# EAGLE design Controller v2 (EAGLE 9.6.2)
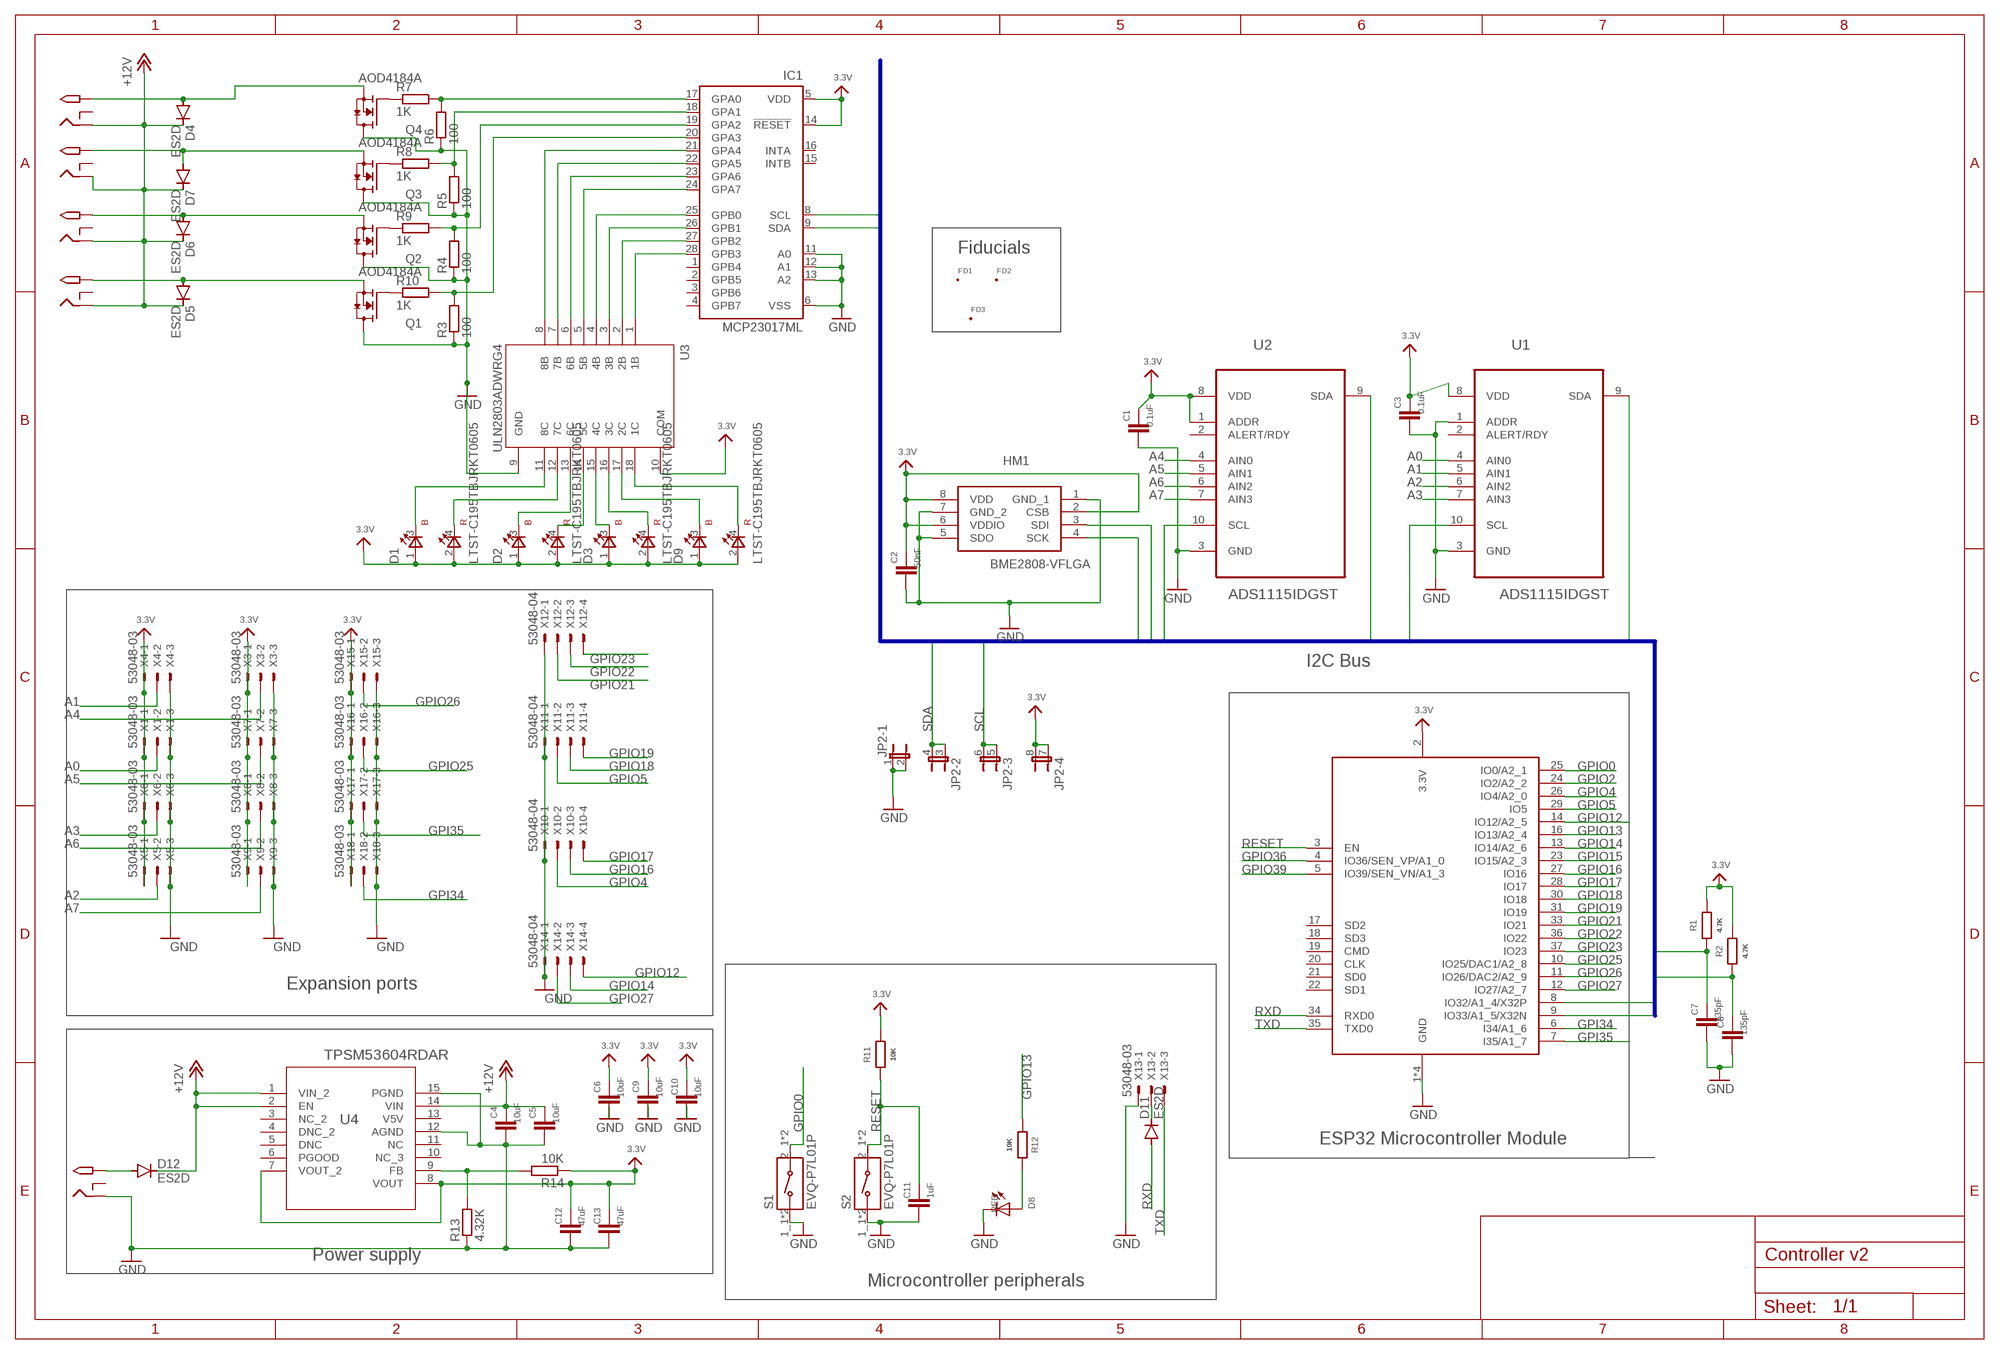
[diagram p0: schematic, sheet 1]

## Parts
12V_OUT_A  2.1MMJACKTHM  [PJ-102A]
12V_OUT_B  2.1MMJACKTHM  [PJ-102A]
12V_OUT_C  2.1MMJACKTHM  [PJ-102A]
12V_OUT_D  2.1MMJACKTHM  [PJ-102A]
C1  0.1uF  C-EUC0603  [C0603]
C2  50nF  C-EUC0603  [C0603]
C3  0.1uF  C-EUC0603  [C0603]
C4  10uF  C-EUC0805K  [C0805K]
C5  10uF  C-EUC0805K  [C0805K]
C6  10uF  C-EUC0805K  [C0805K]
C7  135pF  C-EUC0603  [C0603]
C8  135pF  C-EUC0603  [C0603]
C9  10uF  C-EUC0805K  [C0805K]
C10  10uF  C-EUC0805K  [C0805K]
C11  1uF  C-EUC0805K  [C0805K]
C12  47uF  C-EUC0805K  [C0805K]
C13  47uF  C-EUC0805K  [C0805K]
D1  LTST-C195TBJRKT0605  [LED_LTST-C195TBJRKT]
D2  LTST-C195TBJRKT0605  [LED_LTST-C195TBJRKT]
D3  LTST-C195TBJRKT0605  [LED_LTST-C195TBJRKT]
D4  ES2D  [SMB]
D5  ES2D  [SMB]
D6  ES2D  [SMB]
D7  ES2D  [SMB]
D8  RED  LEDCHIPLED_0805  [CHIPLED_0805]
D9  LTST-C195TBJRKT0605  [LED_LTST-C195TBJRKT]
D11  ES2D  [SMB]
D12  ES2D  [SMB]
FD1  FID_20MIL  [FID_020]
FD2  FID_20MIL  [FID_020]
FD3  FID_20MIL  [FID_020]
HM1  BME2808-VFLGA  [BME280]
IC1  MCP23017ML  [QFN28-ML_6X6MM]
JP2  3.3V  JP4QE  [JP4Q]
PWRIN  2.1MMJACKTHM  [PJ-102A]
Q1  AOD4184A  [D-PAK_TO252AA]
Q2  AOD4184A  [D-PAK_TO252AA]
Q3  AOD4184A  [D-PAK_TO252AA]
Q4  AOD4184A  [D-PAK_TO252AA]
R1  4.7K  R-EU_R0805  [R0805]
R2  4.7K  R-EU_R0805  [R0805]
R3  100  R-EU_R0402  [R0402]
R4  100  R-EU_R0402  [R0402]
R5  100  R-EU_R0402  [R0402]
R6  100  R-EU_R0402  [R0402]
R7  1K  R-EU_R0402  [R0402]
R8  1K  R-EU_R0402  [R0402]
R9  1K  R-EU_R0402  [R0402]
R10  1K  R-EU_R0402  [R0402]
R11  10K  R-EU_R0603  [R0603]
R12  10K  R-EU_R0805  [R0805]
R13  4.32K  R-EU_R0402  [R0402]
R14  10K  R-EU_R0402  [R0402]
S1  EVQ-P7L01P  [SW_EVQ-P7L01P]
S2  EVQ-P7L01P  [SW_EVQ-P7L01P]
U1  ADS1115IDGST  [SOP50P490X110-10N]
U2  ADS1115IDGST  [SOP50P490X110-10N]
U3  ULN2803ADWRG4  [SOIC127P1030X265-18N]
U4  TPSM53604RDAR  [B3QFN14_RDA_TEX]
X1  53048-03  [53048-03]
X2  ESP32_WROOM32  [WROOM32]
X3  53048-03  [53048-03]
X4  53048-03  [53048-03]
X5  53048-03  [53048-03]
X6  53048-03  [53048-03]
X7  53048-03  [53048-03]
X8  53048-03  [53048-03]
X9  53048-03  [53048-03]
X10  53048-04  [53048-04]
X11  53048-04  [53048-04]
X12  53048-04  [53048-04]
X13  53048-03  [53048-03]
X14  53048-04  [53048-04]
X15  53048-03  [53048-03]
X16  53048-03  [53048-03]
X17  53048-03  [53048-03]
X18  53048-03  [53048-03]

## Nets
3.3V: C1.1 C2.1 C3.1 C6.1 C9.1 C10.1 C12.1 C13.1 D1.1(A1) D1.2(A2) D2.1(A1) D2.2(A2) D3.1(A1) D3.2(A2) D9.1(A1) D9.2(A2) HM1.2(CSB) HM1.6(VDDIO) HM1.8(VDD) IC1.5(VDD) IC1.14(!RESET) JP2.7 JP2.8 R1.2 R2.2 R11.2 R14.1 U1.8(VDD) U2.1(ADDR) U2.8(VDD) U3.10(COM) U4.7(VOUT_2) U4.8(VOUT) X1.1 X2.2(3.3V) X3.1 X4.1 X5.1 X6.1 X7.1 X8.1 X9.1 X15.1 X16.1 X17.1 X18.1
+12V: 12V_OUT_A.RING 12V_OUT_B.RING 12V_OUT_C.RING 12V_OUT_D.RING C4.1 C5.1 D4.C D5.C D6.C D7.C D12.C U4.1(VIN_2) U4.2(EN) U4.14(VIN)
A0: U1.4(AIN0) X1.2
A1: U1.5(AIN1) X4.2
A2: U1.6(AIN2) X5.2
A3: U1.7(AIN3) X6.2
A4: U2.4(AIN0) X3.2
A5: U2.5(AIN1) X7.2
A6: U2.6(AIN2) X8.2
A7: U2.7(AIN3) X9.2
GND: C1.2 C2.2 C3.2 C4.2 C5.2 C6.2 C7.2 C8.2 C9.2 C10.2 C11.2 C12.2 C13.2 D8.C HM1.1(GND_1) HM1.5(SDO) HM1.7(GND_2) IC1.6(VSS) IC1.11(A0) IC1.12(A1) IC1.13(A2) JP2.1 JP2.2 PWRIN.RING Q1.4(D) Q2.4(D) Q3.4(D) Q4.4(D) R3.1 R4.1 R5.1 R6.1 R13.1 S1.1_1 S1.1_2 S2.1_1 S2.1_2 U1.1(ADDR) U1.3(GND) U2.3(GND) U3.9(GND) U4.12(AGND) U4.15(PGND) X1.3 X2.1(GND) X2.15(GND) X2.38(GND) X2.P$1(GND) X3.3 X4.3 X5.3 X6.3 X7.3 X8.3 X9.3 X10.1 X11.1 X12.1 X13.1 X14.1 X15.3 X16.3 X17.3 X18.3
GPI34: X2.6(I34/A1_6) X18.2
GPI35: X2.7(I35/A1_7) X17.2
GPIO0: S1.2_1 S1.2_2 X2.25(IO0/A2_1)
GPIO2: X2.24(IO2/A2_2)
GPIO4: X2.26(IO4/A2_0) X10.2
GPIO5: X2.29(IO5) X11.2
GPIO12: X2.14(IO12/A2_5) X14.4
GPIO13: R12.1 X2.16(IO13/A2_4)
GPIO14: X2.13(IO14/A2_6) X14.3
GPIO15: X2.23(IO15/A2_3)
GPIO16: X2.27(IO16) X10.3
GPIO17: X2.28(IO17) X10.4
GPIO18: X2.30(IO18) X11.3
GPIO19: X2.31(IO19) X11.4
GPIO21: X2.33(IO21) X12.2
GPIO22: X2.36(IO22) X12.3
GPIO23: X2.37(IO23) X12.4
GPIO25: X2.10(IO25/DAC1/A2_8) X16.2
GPIO26: X2.11(IO26/DAC2/A2_9) X15.2
GPIO27: X2.12(IO27/A2_7) X14.2
GPIO36: X2.4(IO36/SEN_VP/A1_0)
GPIO39: X2.5(IO39/SEN_VN/A1_3)
N$1: IC1.17(GPA0) R6.2 R7.2
N$2: IC1.18(GPA1) R5.2 R8.2
N$3: IC1.20(GPA3) R3.2 R10.2
N$4: IC1.19(GPA2) R4.2 R9.2
N$5: Q1.1(G) R10.1
N$6: D12.A PWRIN.TIP
N$7: Q2.1(G) R9.1
N$8: IC1.21(GPA4) U3.8(8B)
N$9: Q3.1(G) R8.1
N$10: Q4.1(G) R7.1
N$11: D11.C X13.2
N$12: IC1.22(GPA5) U3.7(7B)
N$13: IC1.23(GPA6) U3.6(6B)
N$14: IC1.24(GPA7) U3.5(5B)
N$15: D8.A R12.2
N$16: IC1.25(GPB0) U3.4(4B)
N$17: IC1.26(GPB1) U3.3(3B)
N$18: IC1.27(GPB2) U3.2(2B)
N$19: IC1.28(GPB3) U3.1(1B)
N$20: D1.3(K1) U3.11(8C)
N$21: D1.4(K2) U3.12(7C)
N$22: D2.3(K1) U3.13(6C)
N$23: D2.4(K2) U3.14(5C)
N$24: D3.3(K1) U3.15(4C)
N$25: D3.4(K2) U3.16(3C)
N$26: D9.3(K1) U3.17(2C)
N$27: D9.4(K2) U3.18(1C)
N$29: R13.2 R14.2 U4.9(FB)
RESET: C11.1 R11.1 S2.2_1 S2.2_2 X2.3(EN)
RXD: D11.A X2.34(RXD0)
SCL: C7.1 HM1.4(SCK) IC1.8(SCL) JP2.5 JP2.6 R1.1 U1.10(SCL) U2.10(SCL) X2.9(IO33/A1_5/X32N)
SDA: C8.1 HM1.3(SDI) IC1.9(SDA) JP2.3 JP2.4 R2.1 U1.9(SDA) U2.9(SDA) X2.8(IO32/A1_4/X32P)
TXD: X2.35(TXD0) X13.3
V_COL1: 12V_OUT_A.TIP D4.A Q4.3(S)
V_COL2: 12V_OUT_B.TIP D7.A Q3.3(S)
V_COL3: 12V_OUT_C.TIP D6.A Q2.3(S)
V_COL4: 12V_OUT_D.TIP D5.A Q1.3(S)
Unconnected: 12V_OUT_A.RING_SW 12V_OUT_B.RING_SW 12V_OUT_C.RING_SW 12V_OUT_D.RING_SW IC1.1(GPB4) IC1.2(GPB5) IC1.3(GPB6) IC1.4(GPB7) IC1.15(INTB) IC1.16(INTA) PWRIN.RING_SW U1.2(ALERT/RDY) U2.2(ALERT/RDY) U4.3(NC_2) U4.4(DNC_2) U4.5(DNC) U4.6(PGOOD) U4.10(NC_3) U4.11(NC) U4.13(V5V) X2.17(SD2) X2.18(SD3) X2.19(CMD) X2.20(CLK) X2.21(SD0) X2.22(SD1)

## Buses
I2C:SCL,SDA

## Notes on the sheet
- Fiducials
- I2C Bus
- Expansion ports
- ESP32 Microcontroller Module
- Power supply
- Microcontroller peripherals

## Library data of the parts
12V_OUT_A 12V_OUT_B 12V_OUT_C 12V_OUT_D PWRIN = adafruit:2.1MMJACK: 2.1mm x 5.5mm THM DC jack with internal switch. Digikey part #PJ-102A, 4UCON part #05537 2.1mm x 5.5mm SMT DC jack with internal switch. Digikey part #PJ-002A-SMT, 4UCON part #03267 By microbuilder.eu & adafruit.com; DATASHEET: https://www.cuidevices.com/product/resource/pj-102a.pdf; DESCRIPTION: CONN PWR JACK 2X5.5MM SOLDER; MF: CUI Devices; MPN: PJ-102A; TYPE: PTH
C1-C13 = rcl:C-EU: CAPACITOR, European symbol; SPICEPREFIX: C
D1-D3 D9 = LTST-C195TBJRKT:LTST-C195TBJRKT: Blue/Red 1.6 x 1.5 x 0.55 mm 130° Clear 45 mcd 3.3/2 V LED SMT; DATASHEET: http://optoelectronics.liteon.com/upload/download/DS22-2001-079/LTST-C195TBJRKT%20.pdf; DESCRIPTION: Blue, Red 470nm Blue, 631nm Red LED Indication - Discrete 3.3V Blue, 2V Red 0605 _1613 Metric_; DIGI-KEY_PART_NUMBER: 160-2020-1-ND; DIGI-KEY_PURCHASE_URL: https://www.digikey.com/product-detail/en/lite-on-inc/LTST-C195TBJRKT/160-2020-1-ND/3711399?utm_source=snapeda&utm_medium=aggregator&utm_campaign=symbol; MF: Lite-On Inc.; MPN: LTST-C195TBJRKT; PACKAGE: 0605 Lite-On; TYPE: SMD
D4-D7 D11 D12 = diode:ES2D: DIODE super fast rectifier, 2 A; DATASHEET: https://www.onsemi.com/pub/Collateral/ES2D-D.pdf; DESCRIPTION: DIODE GEN PURP 200V 2A DO214AA; DIGI-KEY-PART-NUMBER: ES2DFSCT-ND; MF: ON Semiconductor; MPN: ES2D; PACKAGE: DO-214AA, SMB; TYPE: SMD
D8 = adafruit:LED: LED OSRAM: - CHIPLED LG R971, LG N971, LY N971, LG Q971, LY Q971, LO R971, LY R971 LH N974, LH R974 LS Q976, LO Q976, LY Q976 LO Q996 - Hyper CHIPLED LW Q18S LB Q993, LB Q99A, LB R99A - SideLED LS A670, LO A670, LY A670, LG A670, LP A670 LB A673, LV A673, LT A673, LW A673 LH A674 LY A675 LS A676, LA A676, LO A676, LY A676, LW A676 LS A679, LY A679, LG A679 - Hyper Micro SIDELED® LS Y876, LA Y876, LO Y876, LY Y876 LT Y87S - SmartLED LW L88C, LW L88S LB L89C, LB L89S, LG L890 LS L89K, LO L89K, LY L89K LS L896, LA L896, LO L896, LY L896 - TOPLED LS T670, LO T670, LY T670, LG T670, LP T670 LSG T670, LSP T670, LSY T670, LOP T670, LYG T670 LG T671, LOG T671, LSG T671 LB T673, LV T673, LT T673, LW T673 LH T674 LS T676, LA T676, LO T676, LY T676, LB T676, LH T676, LSB T676, LW T676 LB T67C, LV T67C, LT T67C, LS T67K, LO T67K, LY T67K, LW E67C LS E67B, LA E67B, LO E67B, LY E67B, LB E67C, LV E67C, LT E67C LW T67C LS T679, LY T679, LG T679 LS T770, LO T770, LY T770, LG T770, LP T770 LB T773, LV T773, LT T773, LW T773 LH T774 LS E675, LA E675, LY E675, LS T675 LS T776, LA T776, LO T776, LY T776, LB T776 LHGB T686 LT T68C, LB T68C - Hyper Mini TOPLED® LB M676 - Mini TOPLED Santana® LG M470 LS M47K, LO M47K, LY M47K Source: http://www.osram.convergy.de/
FD1-FD3 = Fiducial:FID: Fiducial marks. Top and Bottom copper with stop mask
HM1 = SamacSys_Parts:BME280: Board Mount Humidity Sensors Source: Datasheet <https://componentsearchengine.com/Datasheets/1/BME280.pdf>; DATASHEET: https://ae-bst.resource.bosch.com/media/_tech/media/datasheets/BST-BME280-DS002.pdf; DESCRIPTION: Board Mount Humidity Sensors; MF: Bosch Sensortec; MPN: BME280; PACKAGE: 8-VFLGA; TYPE: SMD
IC1 = microchip:MCP23017: http://ww1.microchip.com/downloads/en/DeviceDoc/21952a.pdf Source: http://ww1.microchip.com/downloads/en/DeviceDoc/21952a.pdf; DATASHEET: http://ww1.microchip.com/downloads/en/DeviceDoc/20001952C.pdf; MF: MICROCHIP; MPN: MCP23017-E/ML; OC_FARNELL: unknown; OC_NEWARK: 31K2957; PACKAGE: 28-VQFN Exposed Pad; TYPE: SMD
JP2 = jumper:JP4QE: JUMPER
Q1-Q4 = AOD4184A:AOD4184A: Trans MOSFET N-CH 40V 50A 3-Pin(2+Tab) DPAK; DESCRIPTION: N-Channel 40V 13A _Ta_, 50A _Tc_ 2.3W _Ta_, 50W _Tc_ Surface Mount TO-252, _D-Pak_; DIGI-KEY_PART_NUMBER: 785-1221-1-ND; DIGI-KEY_PURCHASE_URL: https://www.digikey.com/product-detail/en/alpha-omega-semiconductor-inc/AOD4184A/785-1221-1-ND/2353939?utm_source=snapeda&utm_medium=aggregator&utm_campaign=symbol; MF: Alpha &; MPN: AOD4184A; PACKAGE: Surface Mount TO-252 (D-Pak); TYPE: SMD
R1 R2 = rcl:R-EU_: RESISTOR, European symbol; PACKAGE: R0603; SPICEPREFIX: R
R3-R10 R13 R14 = rcl:R-EU_: RESISTOR, European symbol; PACKAGE: R0402; SPICEPREFIX: R
R11 R12 = rcl:R-EU_: RESISTOR, European symbol; PACKAGE: 0603; SPICEPREFIX: R
S1 S2 = EVQ-P7L01P:EVQ-P7L01P: Switch Tactile N.O. SPST Rectangular Button Gull Wing 0.05A 12VDC 100000Cycle 1.6N SMD Embossed T/R; DESCRIPTION: SWITCH TACTILE SPST-NO 0.05A 12V; DIGI-KEY_PART_NUMBER: P16769CT-ND; DIGI-KEY_PURCHASE_URL: https://www.digikey.com/product-detail/en/panasonic-electronic-components/EVQ-P7L01P/P16769CT-ND/4429462?utm_source=snapeda&utm_medium=aggregator&utm_campaign=symbol; MF: Panasonic Electronic Components; MPN: EVQ-P7L01P; PACKAGE: SPST; TYPE: SMD
U1 U2 = Texas Instruments_By_element14_Batch_1:ADS1115IDGST: Analog-to-Digital Converter with Internal Reference; DATASHEET: http://www.ti.com/general/docs/suppproductinfo.tsp?distId=10&gotoUrl=http%3A%2F%2Fwww.ti.com%2Flit%2Fgpn%2Fads1113; MF: Texas Instruments; MPN: ADS1115IDGST; OC_FARNELL: 1762981; OC_NEWARK: 25R1241; PACKAGE: MSOP-10; TYPE: SMD
U3 = ULN2803ADWRG4:ULN2803ADWRG4: Trans Darlington NPN 50V 0.5A 18-Pin SOIC T/R; DATASHEET: http://www.ti.com/general/docs/suppproductinfo.tsp?distId=10&gotoUrl=http%3A%2F%2Fwww.ti.com%2Flit%2Fgpn%2Fuln2803a; DESCRIPTION: Bipolar _BJT_ Transistor Array 8 NPN Darlington 50V 500mA Surface Mount 18-SOIC; DIGI-KEY_PART_NUMBER: 296-35964-1-ND; DIGI-KEY_PURCHASE_URL: https://www.digikey.com/product-detail/en/texas-instruments/ULN2803ADWRG4/296-35964-1-ND/4134939?utm_source=snapeda&utm_medium=aggregator&utm_campaign=symbol; MF: Texas Instruments; MPN: ULN2803ADWRG4; PACKAGE: SOIC-18 Texas Instruments; TYPE: SMD
U4 = TPSM53604:TPSM53604RDAR; BUILT_BY: EMA_Cory; COPYRIGHT: Copyright (C) 2018 Accelerated Designs. All rights reserved; DATASHEET: https://www.ti.com/lit/ds/symlink/tpsm53604.pdf; MANUFACTURER_PART_NUMBER: TPSM53604RDAR; SOURCELIBRARY: TI_2020-03-16; VENDOR: Texas Instruments
X1 X3-X9 X13 X15-X18 = con-molex:53?-03: CONNECTOR wire to board 1.25 mm (.049 inch) pitch header; DATASHEET: https://www.molex.com/webdocs/datasheets/pdf/en-us/0530480310_PCB_HEADERS.pdf; MF: WALDOM/MOLEX; MPN: 53048-0310; OC_FARNELL: 9732918; OC_NEWARK: 38C9908; TYPE: PTH
X2 = microbuilder:ESP32_WROOM32; DESCRIPTION: ESP32 Module - DO NOT ASSEMBLE; MF: N/A; MPN: N/A; PACKAGE: IGNORE - DO NOT ASSEMBLE; TYPE: IGNORE - DO NOT ASSEMBLE
X10-X12 X14 = con-molex:53?-04: CONNECTOR wire to board 1.25 mm (.049 inch) pitch header; DATASHEET: https://www.molex.com/webdocs/datasheets/pdf/en-us/0530480410_PCB_HEADERS.pdf; MF: MOLEX; MPN: 53048-0410; OC_FARNELL: 1462887; OC_NEWARK: 57H4721; TYPE: PTH

## Board
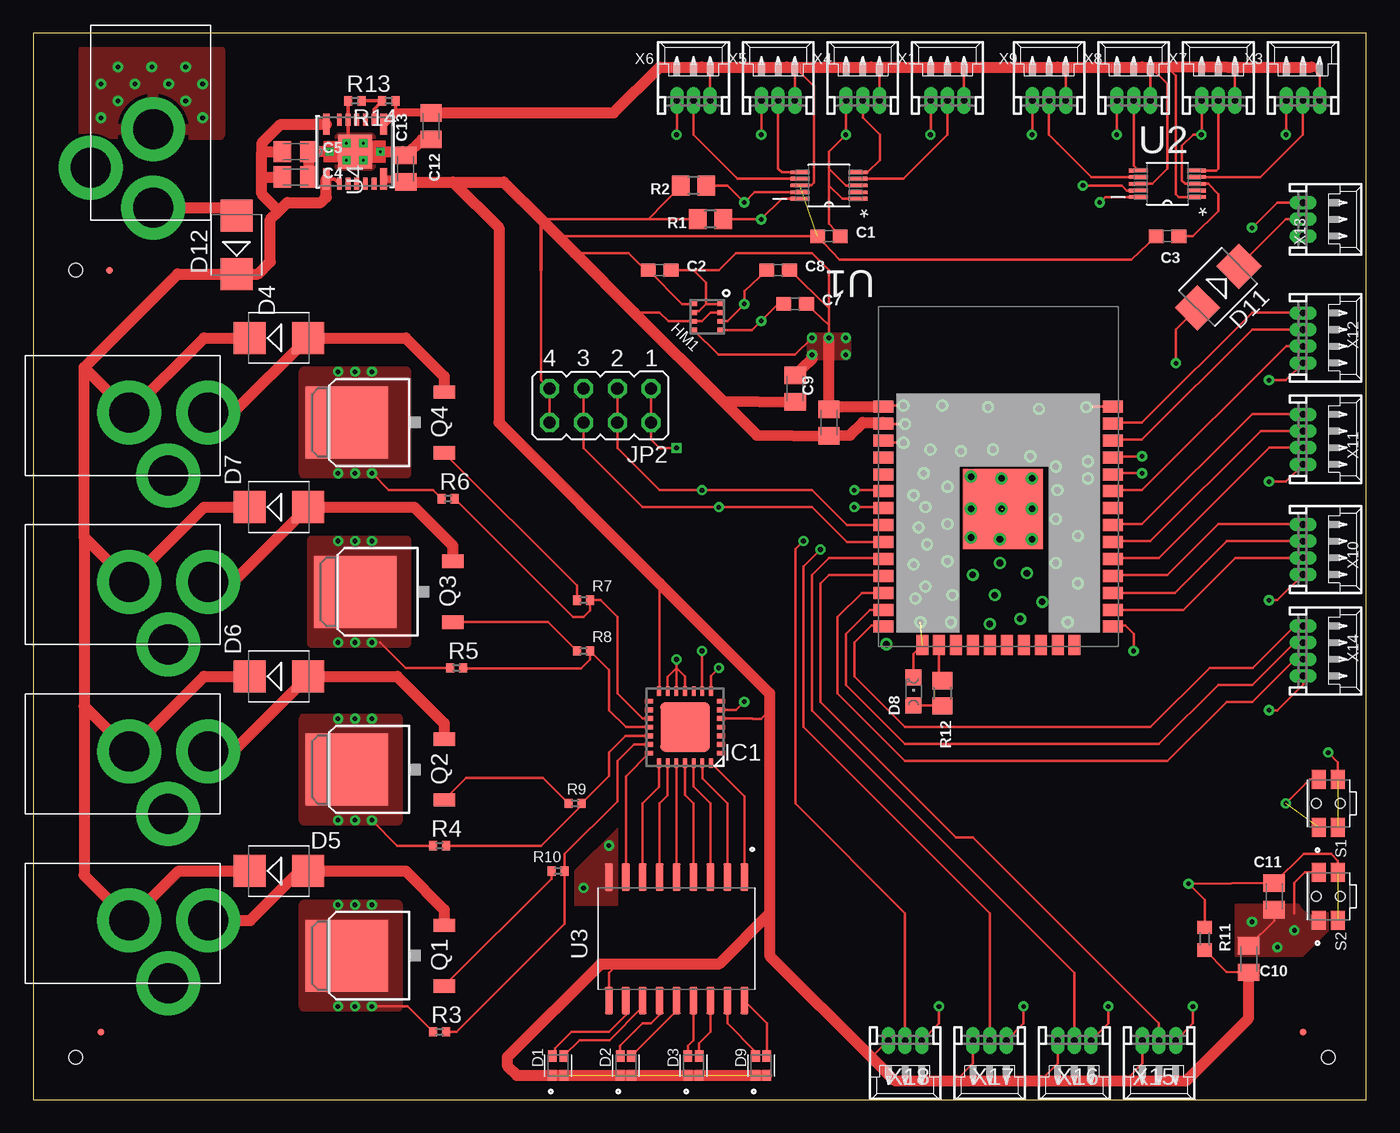
[diagram p1: board, top side]
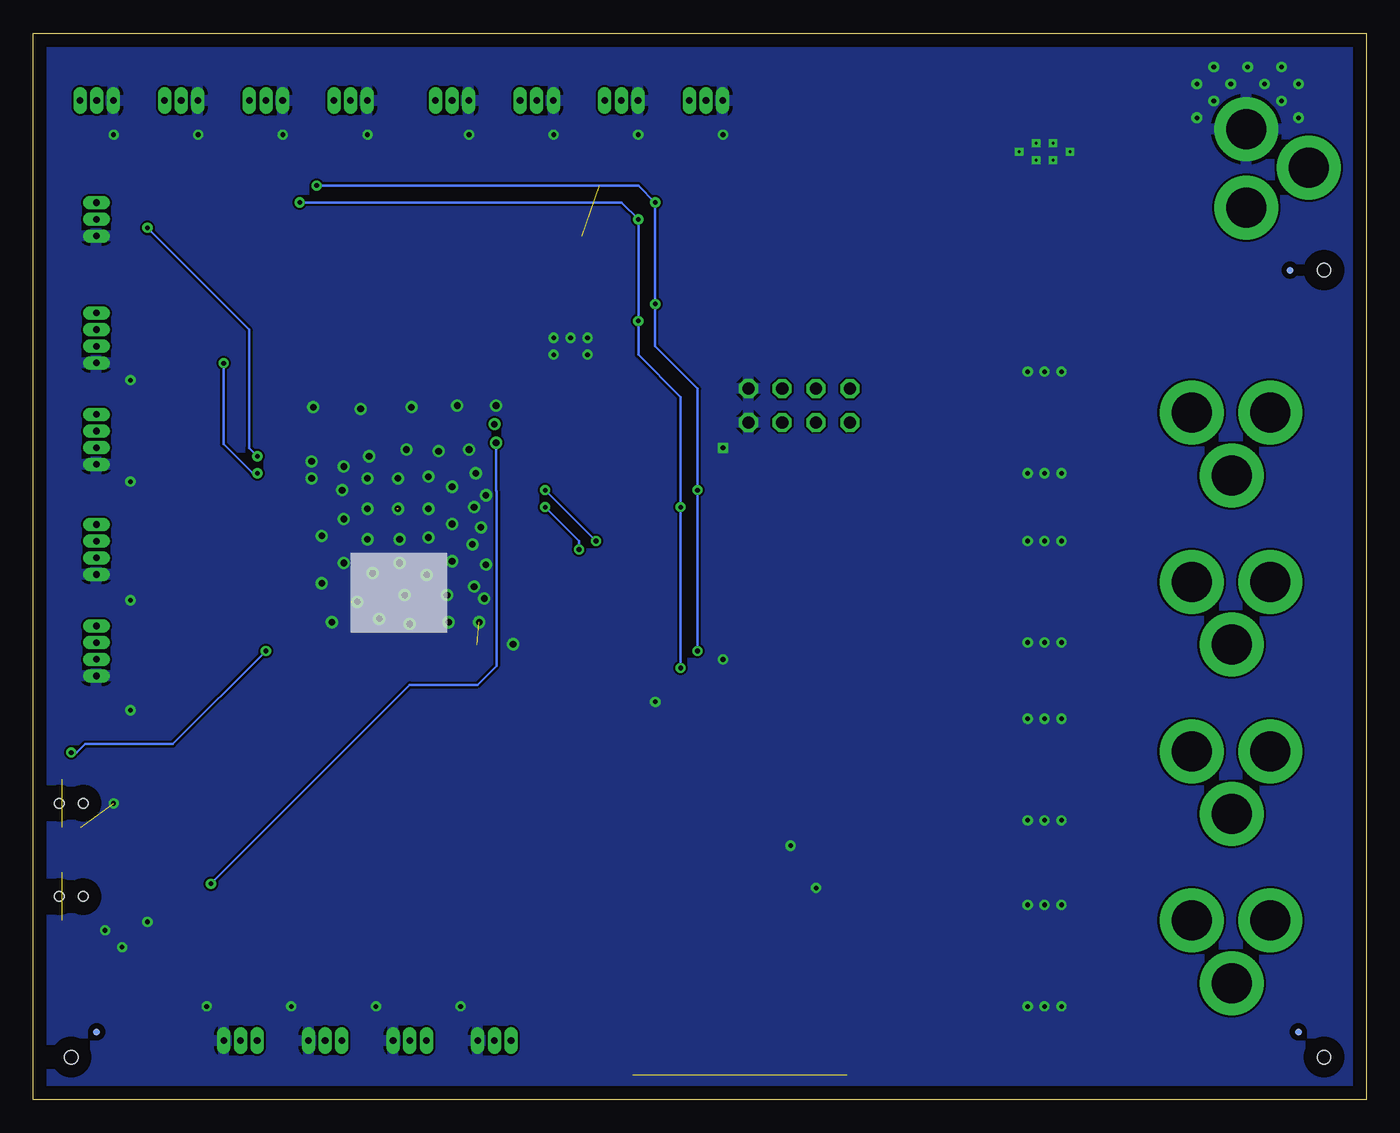
[diagram p2: board, bottom side, seen from below]

Size 100 x 80 mm. Coordinates in mm from the lower left corner, seen from the top.
Outline: 0,0 100,0 100,80 0,80 0,0
Copper layers (1*16): Top 0.035mm / dielectric 1.5mm / Bottom 0.035mm
Design rules "default *": minimum track width 6mil, minimum drill 0.35mm, track to track 6mil, track to pad 6mil, pad to pad 6mil, via to via 6mil, smd to smd 6mil, copper to edge 40mil, drill to drill 6mil, minimum pad ring 10mil, minimum via ring 8mil, stop-mask expansion 4mil, vias tented up to drill 0mil, thermal gap 10mil
Holes 1 mm at 3.17,3.17 97.16,3.17 3.17,62.23

### Footprints (pad centres in the part's own frame; a part is rotated, then mirrored left to right if it is on the bottom)
PJ-102A = drill 3 pad 4.8: RING 0.1,-3.39; RING_SW -4.6,-6.29; TIP 0.1,-9.29
C0603 = smd 1.1 x 1: 1 -0.85,0; 2 0.85,0
C0805K = smd 1.3 x 1.6: 1 -1,0; 2 1,0
LED_LTST-C195TBJRKT = smd 0.85 x 0.65: 1 -0.725,0.425; 2 -0.725,-0.425; 3 0.725,0.425; 4 0.725,-0.425
SMB = smd 2.4 x 2.4: A 2.2,0; C -2.2,0
CHIPLED_0805 = smd 1.2 x 1.2: A 0,-1.05; C 0,1.05
FID_020 = smd 0.508 x 0.508 bottom: FIDB 0,0 | smd 0.508 x 0.508: FIDT 0,0
BME280 = smd 0.5 x 0.35: 1 2.05,0; 2 2.05,-0.65; 3 2.05,-1.3; 4 2.05,-1.95; 5 0,-1.95; 6 0,-1.3; 7 0,-0.65; 8 0,0
QFN28-ML_6X6MM = smd 0.7 x 0.35: 1 -2.7,1.95; 2 -2.7,1.3; 3 -2.7,0.65; 4 -2.7,0; 5 -2.7,-0.65; 6 -2.7,-1.3; 7 -2.7,-1.95; 15 2.7,-1.95; 16 2.7,-1.3; 17 2.7,-0.65; 18 2.7,0; 19 2.7,0.65; 20 2.7,1.3; 21 2.7,1.95 | smd 0.35 x 0.7: 8 -1.95,-2.7; 9 -1.3,-2.7; 10 -0.65,-2.7; 11 0,-2.7; 12 0.65,-2.7; 13 1.3,-2.7; 14 1.95,-2.7; 22 1.95,2.7; 23 1.3,2.7; 24 0.65,2.7; 25 0,2.7; 26 -0.65,2.7; 27 -1.3,2.7; 28 -1.95,2.7 | smd 3.7 x 3.7: EXP 0,0
JP4Q = drill 0.914 octagon: 1 -3.81,-1.27; 2 -3.81,1.27; 3 -1.27,-1.27; 4 -1.27,1.27; 5 1.27,-1.27; 6 1.27,1.27; 7 3.81,-1.27; 8 3.81,1.27
D-PAK_TO252AA = smd 1 x 1.6: 1 -2.28,-4.8; 3 2.28,-4.8 | smd 5.4 x 6.2: 4 0,2.5
R0805 = smd 1.3 x 1.5: 1 -0.95,0; 2 0.95,0
R0402 = smd 0.6 x 0.7: 1 -0.5,0; 2 0.5,0
R0603 = smd 1 x 1.1: 1 -0.85,0; 2 0.85,0
SW_EVQ-P7L01P = smd 1.4 x 1.05: 1_1 -1.8,0.725; 1_2 1.8,0.725; 2_1 -1.8,-0.725; 2_2 1.8,-0.725 | hole 0.7: 0,0.9; 0,-0.9
SOP50P490X110-10N = smd 1.422 x 0.279: 1 -2.184,0.991; 2 -2.184,0.508; 3 -2.184,0; 4 -2.184,-0.508; 5 -2.184,-0.991; 6 2.184,-0.991; 7 2.184,-0.508; 8 2.184,0; 9 2.184,0.508; 10 2.184,0.991
SOIC127P1030X265-18N = smd 2.06 x 0.6: 1 -4.64,5.08; 2 -4.64,3.81; 3 -4.64,2.54; 4 -4.64,1.27; 5 -4.64,0; 6 -4.64,-1.27; 7 -4.64,-2.54; 8 -4.64,-3.81; 9 -4.64,-5.08; 10 4.64,-5.08; 11 4.64,-3.81; 12 4.64,-2.54; 13 4.64,-1.27; 14 4.64,0; 15 4.64,1.27; 16 4.64,2.54; 17 4.64,3.81; 18 4.64,5.08
B3QFN14_RDA_TEX = smd 1.6 x 0.508: 1 -2.057,2.145; 7 -2.057,-2.155; 8 2.057,-2.155; 14 2.057,2.145 | smd 0.914 x 0.356: 2 -2.4,1.17; 3 -2.4,0.52; 4 -2.4,-0.13; 5 -2.4,-0.78; 6 -2.4,-1.43; 9 2.4,-1.43; 10 2.4,-0.78; 11 2.4,-0.13; 12 2.4,0.52; 13 2.4,1.17 | smd 2.54 x 2.54: 15 0,0
53048-03 = drill 0.5 pad 0.698 long: 1 1.25,-1.25; 2 0,-1.25; 3 -1.25,-1.25
WROOM32 = smd 1.5 x 0.9: 1 -8.6,5; 2 -8.6,3.73; 3 -8.6,2.46; 4 -8.6,1.19; 5 -8.6,-0.08; 6 -8.6,-1.35; 7 -8.6,-2.62; 8 -8.6,-3.89; 9 -8.6,-5.16; 10 -8.6,-6.43; 11 -8.6,-7.7; 12 -8.6,-8.97; 13 -8.6,-10.24; 14 -8.6,-11.51; 25 8.6,-11.51; 26 8.6,-10.24; 27 8.6,-8.97; 28 8.6,-7.7; 29 8.6,-6.43; 30 8.6,-5.16; 31 8.6,-3.89; 32 8.6,-2.62; 33 8.6,-1.35; 34 8.6,-0.08; 35 8.6,1.19; 36 8.6,2.46; 37 8.6,3.73; 38 8.6,5 | smd 0.9 x 1.5: 15 -5.7,-12.9; 16 -4.43,-12.9; 17 -3.16,-12.9; 18 -1.89,-12.9; 19 -0.62,-12.9; 20 0.65,-12.9; 21 1.92,-12.9; 22 3.19,-12.9; 23 4.46,-12.9; 24 5.73,-12.9 | smd 6 x 6: P$1 0.34,-2.7
53048-04 = drill 0.5 pad 0.698 long: 1 1.875,-1.25; 2 0.625,-1.25; 3 -0.625,-1.25; 4 -1.875,-1.25

### Placement (x,y rotation side)
12V_OUT_A  3.81,51.44 90 top
12V_OUT_B  3.81,38.73 90 top
12V_OUT_C  3.81,26.04 90 top
12V_OUT_D  3.81,13.34 90 top
C1  59.69,64.77 0 top
C2  46.99,62.23 0 top
C3  85.09,64.77 0 top
C4  19.68,69.22 0 top
C5  19.68,71.12 0 top
C6  57.15,53.34 90 top
C7  57.15,59.69 0 top
C8  55.88,62.23 0 top
C9  59.69,50.8 90 top
C10  91.19,10.54 90 top
C11  93.09,15.24 270 top
C12  29.84,73.03 270 top
C13  27.94,69.85 90 top
D1  39.37,2.54 90 top
D2  44.45,2.54 90 top
D3  49.53,2.54 90 top
D4  18.41,57.15 0 top
D5  18.41,17.14 0 top
D6  18.41,31.75 0 top
D7  18.41,44.45 0 top
D8  66.04,30.61 0 top
D9  54.61,2.54 90 top
D11  88.9,60.96 225 top
D12  15.24,64.14 90 top
FD1  5.08,5.08 0 top
FD2  5.71,62.23 0 top
FD3  95.25,5.08 0 top
HM1  49.53,59.69 0 top
IC1  48.9,27.94 180 top
JP2  42.55,52.07 180 top
PWRIN  8.89,76.2 0 top
Q1  26.04,10.79 90 top
Q2  26.04,24.77 90 top
Q3  26.67,38.1 90 top
Q4  26.04,50.8 90 top
R1  50.8,66.04 180 top
R2  49.53,68.58 180 top
R3  30.48,5.08 0 top
R4  30.48,19.05 0 top
R5  31.75,32.38 0 top
R6  31.11,45.09 0 top
R7  41.27,37.47 0 top
R8  41.27,33.66 0 top
R9  40.64,22.23 0 top
R10  39.37,17.14 0 top
R11  87.88,12.06 270 top
R12  68.2,30.48 270 top
R13  24.13,74.93 0 top
R14  26.67,74.93 180 top
S1  97.16,22.23 90 top
S2  97.16,15.24 90 top
U1  59.69,68.58 180 top
U2  85.09,68.71 180 top
U3  48.26,12.06 270 top
U4  24.13,71.12 90 top
X1  68.58,76.2 0 top
X2  72.39,46.99 0 top
X3  95.25,76.2 0 top
X4  62.23,76.2 0 top
X5  55.88,76.2 0 top
X6  49.53,76.2 0 top
X7  88.9,76.2 0 top
X8  82.55,76.2 0 top
X9  76.2,76.2 0 top
X10  96.52,41.27 270 top
X11  96.52,49.53 270 top
X12  96.52,57.15 270 top
X13  96.52,66.04 270 top
X14  96.52,33.66 270 top
X15  84.45,3.17 180 top
X16  78.11,3.17 180 top
X17  71.75,3.17 180 top
X18  65.41,3.17 180 top

### Tracks (layer width: path | path; a pad name or v marks a point on that pad's centre or on a via)
3.3V  (via drill 0.5)  (8 unrouted)
  Top 0.203: 95.89,77.47 96.52,76.83 96.52,74.97 | X7.1 90.15,76.86 89.53,77.47 | X8.1 83.8,76.86 83.19,77.47 | X9.1 77.45,76.86 76.83,77.47 | X1.1 69.83,76.86 69.22,77.47 | X4.1 63.48,76.86 62.87,77.47 | 56.52,77.47 57.15,76.83 57.15,74.97 X5.1 | 50.16,77.47 50.78,76.86 X6.1 50.8,74.93 | U2.8 83.95,68.71 85.09,69.85 85.09,76.2 83.82,77.47 | 85.09,77.47 85.72,76.83 85.72,67.94 85.95,67.72 U2.1 | U1.8 57.52,68.59 58.36,68.59 58.57,68.8 58.57,76.05 57.15,77.47 | R2.2 46.14,66.04 | 46.14,66.04 R1.2 | C3.1 82.39,63.02 60.48,63.02 C1.1 39.37,64.77 | 46.99,38.73 46.99,30.68 IC1.14 | 62.87,3.17 64.11,4.42 X18.1 | 69.22,1.42 70.5,2.71 X17.1 | 75.56,1.42 76.86,2.71 X16.1 | 81.92,1.42 83.2,2.71 X15.1 | 44.88,1.7 D2.2 | 39.8,1.7 D1.2 | 38.65,1.81 D1.1 | IC1.5 53.96,28.59 53.98,28.57 54.61,28.57 55.24,29.21 | v65.41,50.67 63.84,50.67 63.71,50.8 | 43.81,10.16 43.18,9.53 U3.10 | 91.44,9.34 C10.1 89.51,9.59 R11.2 | JP2.8 JP2.7 38.1,53.98 38.1,62.23 | 46.14,66.04 38.1,66.04 | 40.64,63.5 44.67,63.5 46.04,62.13 C2.1 48.68,59.69 HM1.8 | 45.09,59.05 46.99,59.05 47.66,58.39 HM1.6 49.56,58.42 50.16,58.42 50.8,59.05 51.56,59.05 HM1.2
  Top 0.254: 27.17,74.06 R14.1 | 38.1,62.23 38.1,66.04
  Top 0.305: 96.52,74.97 X3.1
  Top 0.61: U4.8 27.17,74.06 29.81,74.06 C12.1 | U4.7 27.73,69.06
  Top 0.813: 95.89,77.47 89.53,77.47 85.09,77.47 83.82,77.47 83.19,77.47 76.83,77.47 69.22,77.47 62.87,77.47 57.15,77.47 56.52,77.47 50.16,77.47 46.99,77.47 43.55,74.03 C12.1 | 51.75,52.39 C6.1 | 51.75,52.39 54.29,49.85 C9.1 61.28,49.85 62.23,50.8 63.71,50.8 X2.2 | 55.24,13.97 55.24,29.21 55.24,30.48 46.99,38.73 34.92,50.8 34.92,65.41 31.48,68.85 | 55.24,13.97 55.24,10.79 62.87,3.17 64.62,1.42 69.22,1.42 75.56,1.42 81.92,1.42 86.51,1.42 91.19,6.1 C10.1 | 55.24,13.97 51.44,10.16 43.81,10.16 42.55,10.16 35.56,3.17 35.56,2.54 36.28,1.81 D9.2 | 51.75,52.39 45.09,59.05 40.64,63.5 39.37,64.77 38.1,66.04 35.29,68.85 31.48,68.85 | 27.73,69.06 C13.1 31.48,68.85
+12V
  Top 0.254: U4.1 22.62,69.06 U4.2
  Top 0.813: 3.81,54.92 12V_OUT_A.RING 12.81,57.15 D4.C | 3.81,42.23 3.81,54.92 | 3.81,42.23 12V_OUT_B.RING 12.81,44.45 D7.C | 3.81,42.23 3.81,29.52 | 3.81,29.52 12V_OUT_C.RING 12.81,31.75 D6.C | 3.81,29.52 3.81,16.82 12V_OUT_D.RING 10.91,17.14 D5.C | 3.81,54.92 10.82,61.94 D12.C 16.85,61.94 17.78,62.87 17.78,66.04 18.41,66.67 | U4.14 18.57,73.18 17.14,71.75 17.14,71.12 | 18.41,66.67 19.05,67.31 21.59,67.31 21.98,67.7 U4.1 | 18.41,66.67 17.14,67.94 17.14,69.22 | 17.14,69.22 17.14,71.12 | 17.14,71.12 C5.1 | 17.14,69.22 C4.1
A0
  Top 0.203: X1.2 68.58,72.39 65.27,69.08 65.25,69.09 U1.4
A1
  Top 0.203: X4.2 62.23,73.66 63.5,72.39 63.5,70.48 62.59,69.57 U1.5
A2
  Top 0.203: X5.2 55.88,69.85 56.16,69.57 U1.6
A3
  Top 0.203: X6.2 49.53,72.39 52.83,69.09 U1.7
A4
  Top 0.203: X3.2 95.25,72.39 92.06,69.2 89.53,69.2 89.52,69.22 U2.4
A5
  Top 0.203: U2.5 88.75,69.7 88.9,69.85 X7.2
A6
  Top 0.203: U2.6 82.55,70.05 X8.2
A7
  Top 0.203: X9.2 76.2,72.39 76.85,71.74 79.38,69.22 U2.7
GND  (via drill 0.2, 0.35, 0.35 pad 0.81, 0.5)  (3 unrouted)
  Top 0.203: X6.3 48.28,72.41 v48.26,72.39 | X5.3 54.63,72.41 v54.61,72.39 | X4.3 60.98,72.41 v60.96,72.39 59.69,71.12 59.69,69.85 | X1.3 67.33,72.41 v67.31,72.39 | X9.3 74.95,72.41 v74.93,72.39 | X8.3 81.3,72.41 v81.28,72.39 | X7.3 87.65,72.41 | 87.65,72.41 v87.63,72.39 | 87.65,72.41 87.02,72.41 86.18,71.58 86.18,68.95 86.43,68.71 U2.3 88.14,68.71 88.9,67.94 88.9,66.67 87,64.77 C3.2 | 59.69,69.85 60.96,68.58 U1.3 | 59.69,69.85 59.69,68.58 | 59.69,68.58 60.69,67.58 61.86,67.58 U1.1 | C7.2 59.69,58.1 | 59.69,58.1 v59.69,57.15 | C8.2 59.69,59.37 | 59.69,59.37 59.69,58.1 | X12.1 93.97,53.98 v92.71,53.98 | X11.1 93.97,46.35 v92.71,46.35 | X10.1 93.33,37.47 v92.71,37.47 | v92.71,29.21 93.33,29.21 95.27,31.14 X14.1 | IC1.13 47.59,31.72 48.26,32.38 | 48.26,32.38 48.26,30.66 IC1.12 | 48.26,32.38 48.9,31.75 IC1.11 | 48.26,32.38 v48.26,33.02 | IC1.6 52.73,29.24 v53.34,29.84 | v25.4,46.99 26.67,45.72 29.98,45.72 R6.1 | R5.1 27.94,32.38 26.04,34.29 | R4.1 27.3,19.05 v25.4,20.95 | v25.4,6.99 28.07,6.99 R3.1 | X3.3 94,72.41 v93.98,72.39 | 85.7,5.06 X15.3 87,5.71 v87,6.99 | X18.3 67.94,5.71 v67.94,6.99 | X17.3 74.3,5.71 v74.3,6.99 | X16.3 80.64,5.71 v80.64,6.99 | v65.28,52.07 63.87,52.07 X2.1 | D8.C 66.04,33.44 X2.15 | S1.1_2 95.78,24.02 v93.98,22.23 | C10.2 93.09,13.4 C11.2 | S2.1_2 95.38,17.04 94.61,16.27 94.61,13.97 | HM1.5 51.39,55.88 57.15,55.88 v58.42,57.15 | HM1.7 49.65,59.16 49.93,59.16 50.46,59.69 | 50.46,59.69 HM1.1 | 50.46,59.69 50.46,61.3 49.53,62.23 | 59.69,68.58 59.69,65.72 C1.2 | 49.53,62.23 51.44,62.23 52.7,63.5 58.42,63.5 59.69,62.23 59.69,59.37 | X2.38 79.04,51.99 v78.99,51.94 | v48.26,48.9 46.99,48.9 46.35,49.53 JP2.2 JP2.1
  Top 0.203: C2.2 49.53,62.23
  Top 0.254: U4.15 23.61,71.64 U4.12 23.61,74.91 R13.1
  Top 0.61: 27.95,70.81 C13.2 27.67,71.12 | C12.2 29.16,72.03
  Top 0.813: C6.2 58.42,55.56 v58.42,55.88 | v59.69,57.15 C9.2 59.93,51.99 X2.1 | C4.2 C5.2 v22.23,71.12 | v26.04,71.12 27.67,71.12 | 29.16,72.03 27.95,70.81
  other vias: 68.83,35.81 71.75,35.69 72.14,37.85 66.93,44.45 68.58,43.18 76.71,47.5 78.36,42.29 79.12,46.61 74.8,48.26 79.12,47.88 75.44,51.82 71.63,51.94 68.2,52.07 66.04,45.34 67.31,48.77 67.06,41.66 66.04,40.13 66.17,37.59 64.01,34.16 66.55,35.81 78.36,38.73 75.69,37.34 70.36,46.74 70.36,44.32 70.36,42.16 72.52,42.04 74.93,42.04 74.93,44.32 74.93,46.61 72.64,46.61 72.64,44.32 77.6,35.81 66.93,38.48 68.58,40.39 72.52,40.26 70.48,39.37 68.96,37.85 66.42,42.93 76.71,40.26 76.71,43.56 72.01,48.77 76.83,45.72 74.04,36.07 74.55,39.5 69.6,48.64 68.58,45.97 66.8,46.99 5.08,76.2 6.35,77.47 7.62,76.2 6.35,74.93 5.08,73.66 10.16,76.2 12.7,76.2 11.43,77.47 11.43,74.93 12.7,73.66 8.89,77.47 60.96,57.15 60.96,55.88 24.13,14.61 22.86,14.61 25.4,14.61 22.86,6.99 24.13,6.99 22.86,20.95 24.13,20.95 22.86,28.57 24.13,28.57 25.4,28.57 22.86,34.29 24.13,34.29 25.4,34.29 22.86,41.91 24.13,41.91 25.4,41.91 22.86,46.99 24.13,46.99 22.86,54.61 24.13,54.61 25.4,54.61 91.44,13.34 94.61,12.7 93.34,11.43 41.27,15.88 43.18,19.05 23.5,71.75 24.77,71.75 24.77,70.48 23.5,70.48
  pour Top: 13.97,72.39 3.81,72.39 3.81,78.74 13.97,78.74
  pour Bottom: 0,80.01 100.33,80.01 100.33,0 0,0
  pour Bottom: 64.77,52.83 80.01,52.83 80.01,35.05 64.77,35.05
  pour Bottom: 58.42,57.15 58.42,55.88 60.96,55.88 60.96,57.15
  pour Top: 58.42,57.15 58.42,55.88 60.96,55.88 60.96,57.15
  pour Top (no thermals): 20.32,14.61 27.3,14.61 27.3,6.99 20.32,6.99
  pour Top (no thermals): 20.32,28.57 27.3,28.57 27.3,20.95 20.32,20.95
  pour Top (no thermals): 20.95,41.91 27.94,41.91 27.94,34.29 20.95,34.29
  pour Top (no thermals): 20.32,54.61 27.94,54.61 27.94,46.99 20.32,46.99
  pour Top (no thermals): 90.17,14.61 90.17,10.79 95.25,10.79 97.16,12.7 97.16,13.97 96.52,13.97 95.89,14.61
  pour Top (rank 2, no thermals): 40.64,14.61 43.81,14.61 43.81,20.32 40.64,17.14
  pour Top (no thermals): 21.59,71.75 21.59,70.48 22.23,70.48 22.86,69.85 25.4,69.85 26.04,70.48 26.67,70.48 26.67,71.75 26.04,71.75 25.4,72.39 22.86,72.39 22.23,71.75
GPI34  (via drill 0.35)
  Top 0.203: v61.59,45.72 63.71,45.72 X2.6 | X18.2 65.41,13.97 57.17,22.2 57.17,41.3 v57.78,41.91
  Bottom 0.203: v57.78,41.91 v61.59,45.72
GPI35  (via drill 0.35)
  Top 0.203: v61.59,44.45 63.71,44.45 X2.7 | X17.2 71.75,13.97 57.78,27.94 57.78,40.01 v59.05,41.27
  Bottom 0.203: v59.05,41.27 59.05,41.91 v61.59,44.45
GPIO0  (via drill 0.35)  (1 unrouted)
  Top 0.203: X2.25 81.07,35.56 81.92,35.56 82.55,34.92 v82.55,33.66 | v97.16,26.04 97.88,25.31 S1.2_2
  Bottom 0.203: v82.55,33.66 89.53,26.67 96.11,26.67 96.75,26.04 v97.16,26.04
GPIO4
  Top 0.203: X2.26 86.28,36.75 90.18,40.65 X10.2
GPIO5
  Top 0.203: X2.29 81.07,40.64 84.45,40.64 92.72,48.91 X11.2
GPIO12
  Top 0.203: X14.4 94.64,35.53 91.49,32.38 88.27,32.38 83.82,27.94 65.41,27.94 61.59,31.75 61.59,34.29 62.87,35.56 63.71,35.56 X2.14
GPIO13
  Top 0.203: X2.16 67.96,31.57 R12.1
GPIO14
  Top 0.203: X2.13 62.78,36.75 60.96,34.92 60.96,31.11 65.41,26.67 84.45,26.67 88.9,31.11 91.47,31.11 94.64,34.28 X14.3
GPIO16
  Top 0.203: X2.27 85.64,38.02 89.53,41.9 X10.3
GPIO17
  Top 0.203: X2.28 81.07,39.37 85.09,39.37 88.9,43.18 95.24,43.18 X10.4
GPIO18
  Top 0.203: X2.30 81.07,41.91 83.82,41.91 92.08,50.16 X11.3
GPIO19
  Top 0.203: X2.31 81.07,43.18 83.19,43.18 91.44,51.44 95.24,51.44 X11.4
GPIO21
  Top 0.203: X2.33 81.07,45.72 83.19,45.72 93.99,56.52 X12.2
GPIO22
  Top 0.203: X2.36 81.07,49.53 83.19,49.53 91.44,57.78 95.26,57.78 X12.3
GPIO23
  Top 0.203: X2.37 81.07,50.8 83.19,50.8 91.44,59.05 95.24,59.05 X12.4
GPIO25
  Top 0.203: X2.10 63.71,40.64 59.69,40.64 58.42,39.37 58.42,29.21 78.11,9.53 X16.2
GPIO26
  Top 0.203: X2.11 63.71,39.37 59.69,39.37 59.05,38.73 59.05,29.84 69.22,19.68 70.48,19.68 84.45,5.71 X15.2
GPIO27
  Top 0.203: X2.12 62.15,38.02 60.33,36.2 60.33,30.48 65.41,25.4 85.09,25.4 89.53,29.84 91.45,29.84 94.64,33.03 X14.2
N$1
  Top 0.203: IC1.17 45.7,28.59 43.81,30.48 43.81,36.2 42.55,37.47 R7.2 41.77,36.7 41.27,36.2 40.51,36.2 R6.2
N$2
  Top 0.203: R5.2 32.3,32.34 41.09,32.34 41.77,33.02 R8.2 43.18,32.25 43.18,29.21 44.45,27.94 IC1.18
N$3
  Top 0.203: R3.2 31.75,5.08 39.87,13.2 R10.2 39.87,18.41 43.81,22.36 43.81,25.4 45.05,26.64 IC1.20
N$4
  Top 0.203: R4.2 38.1,19.05 41.27,22.23 R9.2 43.18,24.27 43.18,26.04 44.44,27.29 IC1.19
N$5
  Top 0.203: Q1.1 38.87,16.55 R10.1
N$6
  Top 0.813: PWRIN.TIP 14.66,66.91 D12.A
N$7
  Top 0.203: Q2.1 32.48,24.13 38.23,24.13 R9.1
N$8
  Top 0.203: IC1.21 44.45,24.25 U3.8
N$9
  Top 0.203: Q3.1 38.61,35.82 R8.1
N$10
  Top 0.203: R7.1 40.77,38.58 Q4.1
N$11
  Top 0.203: D11.C 93.98,66.04 X13.2
N$12
  Top 0.203: IC1.22 46.95,23.45 45.72,22.23 U3.7
N$13
  Top 0.203: IC1.23 47.59,22.83 46.99,22.23 U3.6
N$14
  Top 0.203: IC1.24 48.24,16.72 U3.5
N$15
  Top 0.203: D8.A 68.13,29.56 R12.2
N$16
  Top 0.203: IC1.25 48.9,22.86 49.53,22.23 U3.4
N$17
  Top 0.203: IC1.26 49.55,23.48 50.8,22.23 U3.3
N$18
  Top 0.203: IC1.27 50.2,24.1 52.07,22.23 U3.2
N$19
  Top 0.203: IC1.28 53.34,22.75 U3.1
N$20
  Top 0.203: D1.3 39.14,3.46 39.14,3.83 40.39,5.08 43.18,5.08 44.45,6.35 U3.11
N$21
  Top 0.203: D1.4 40.98,4.45 43.22,4.45 45.72,6.94 U3.12
N$22
  Top 0.203: D2.3 44.02,4.02 45.72,5.71 46.35,5.71 46.99,6.35 U3.13
N$23
  Top 0.203: D2.4 48.26,6.65 U3.14
N$24
  Top 0.203: D3.3 49.1,4.02 49.53,4.45 U3.15
N$25
  Top 0.203: D3.4 49.95,4.24 50.8,5.08 U3.16
N$26
  Top 0.203: U3.17 52.07,5.71 54.19,3.6 D9.3
N$27
  Top 0.203: U3.18 55.03,5.73 D9.4
N$29
  Top 0.254: U4.9 25.56,74.3 25.56,74.32 26.1,74.86 | 26.1,74.86 R14.2 | R13.2 26.04,74.93 26.1,74.86
RESET  (via drill 0.35, 0.5)  (1 unrouted)
  Top 0.203: v65.28,49.28 63.96,49.28 X2.3 | v86.68,16.19 | v86.68,16.19 C11.1 95.32,18.41 97.38,18.41 97.88,17.92 S2.2_2 | R11.1 87.88,14.99 v86.68,16.19
  Bottom 0.203: v65.28,49.28 65.28,45.69 65.26,45.66 65.26,32.53 66.67,31.11 71.75,31.11 v86.68,16.19
RXD  (via drill 0.35)
  Top 0.203: X2.34 81.07,46.99 v83.19,46.99 | D11.A 85.72,57.78 v85.72,55.24
  Bottom 0.203: v83.19,46.99 83.55,46.99 85.72,49.16 v85.72,55.24
SCL  (via drill 0.35)
  Top 0.203: U1.10 56.16,67.59 v54.61,66.04 R1.1 | X2.9 61.04,41.83 58.42,44.45 v51.44,44.45 45.72,44.45 41.27,48.9 JP2.6 JP2.5 | HM1.4 53.93,57.74 v54.61,58.42 55.88,59.69 C7.1 | IC1.8 50.84,31.8 v51.44,32.38 | U2.10 80.42,67.72 v80.01,67.31
  Bottom 0.203: v80.01,67.31 55.88,67.31 v54.61,66.04 v54.61,58.42 54.61,55.88 51.44,52.7 v51.44,44.45 v51.44,32.38
SDA  (via drill 0.35)
  Top 0.203: U1.9 54.1,68.07 v53.34,67.31 52.07,68.58 R2.1 | v78.74,68.58 81.68,68.58 82.05,68.21 82.89,68.21 U2.9 | X2.8 61.04,43.1 58.42,45.72 v50.16,45.72 46.99,45.72 43.81,48.9 JP2.4 JP2.3 | HM1.3 51.61,58.42 52.07,58.42 v53.34,59.69 53.34,60.64 C8.1 | IC1.9 50.16,30.67 v50.16,33.66
  Bottom 0.203: v78.74,68.58 54.61,68.58 v53.34,67.31 v53.34,59.69 53.34,56.52 50.16,53.34 v50.16,45.72 v50.16,33.66
TXD  (via drill 0.35)
  Top 0.203: X2.35 81.07,48.26 v83.19,48.26 | v91.44,65.41 93.33,67.29 X13.3
  Bottom 0.203: v83.19,48.26 83.82,48.9 83.82,57.78 v91.44,65.41
V_COL1
  Top 0.813: 12V_OUT_A.TIP 15,51.53 D4.A 27.94,57.15 30.84,54.26 Q4.3
V_COL2
  Top 0.813: 12V_OUT_B.TIP 15,38.84 D7.A 28.57,44.45 31.47,41.55 Q3.3
V_COL3
  Top 0.813: 12V_OUT_C.TIP 15,26.14 D6.A 27.3,31.75 30.84,28.22 Q2.3
V_COL4
  Top 0.813: 12V_OUT_D.TIP 16.27,13.44 19.98,17.14 D5.A 27.94,17.14 30.84,14.25 Q1.3